# Altium schematic sheet 15_HEATER.SchDoc
size 420 x 297 mm; SheetNumber: 25; SheetTotal: 36
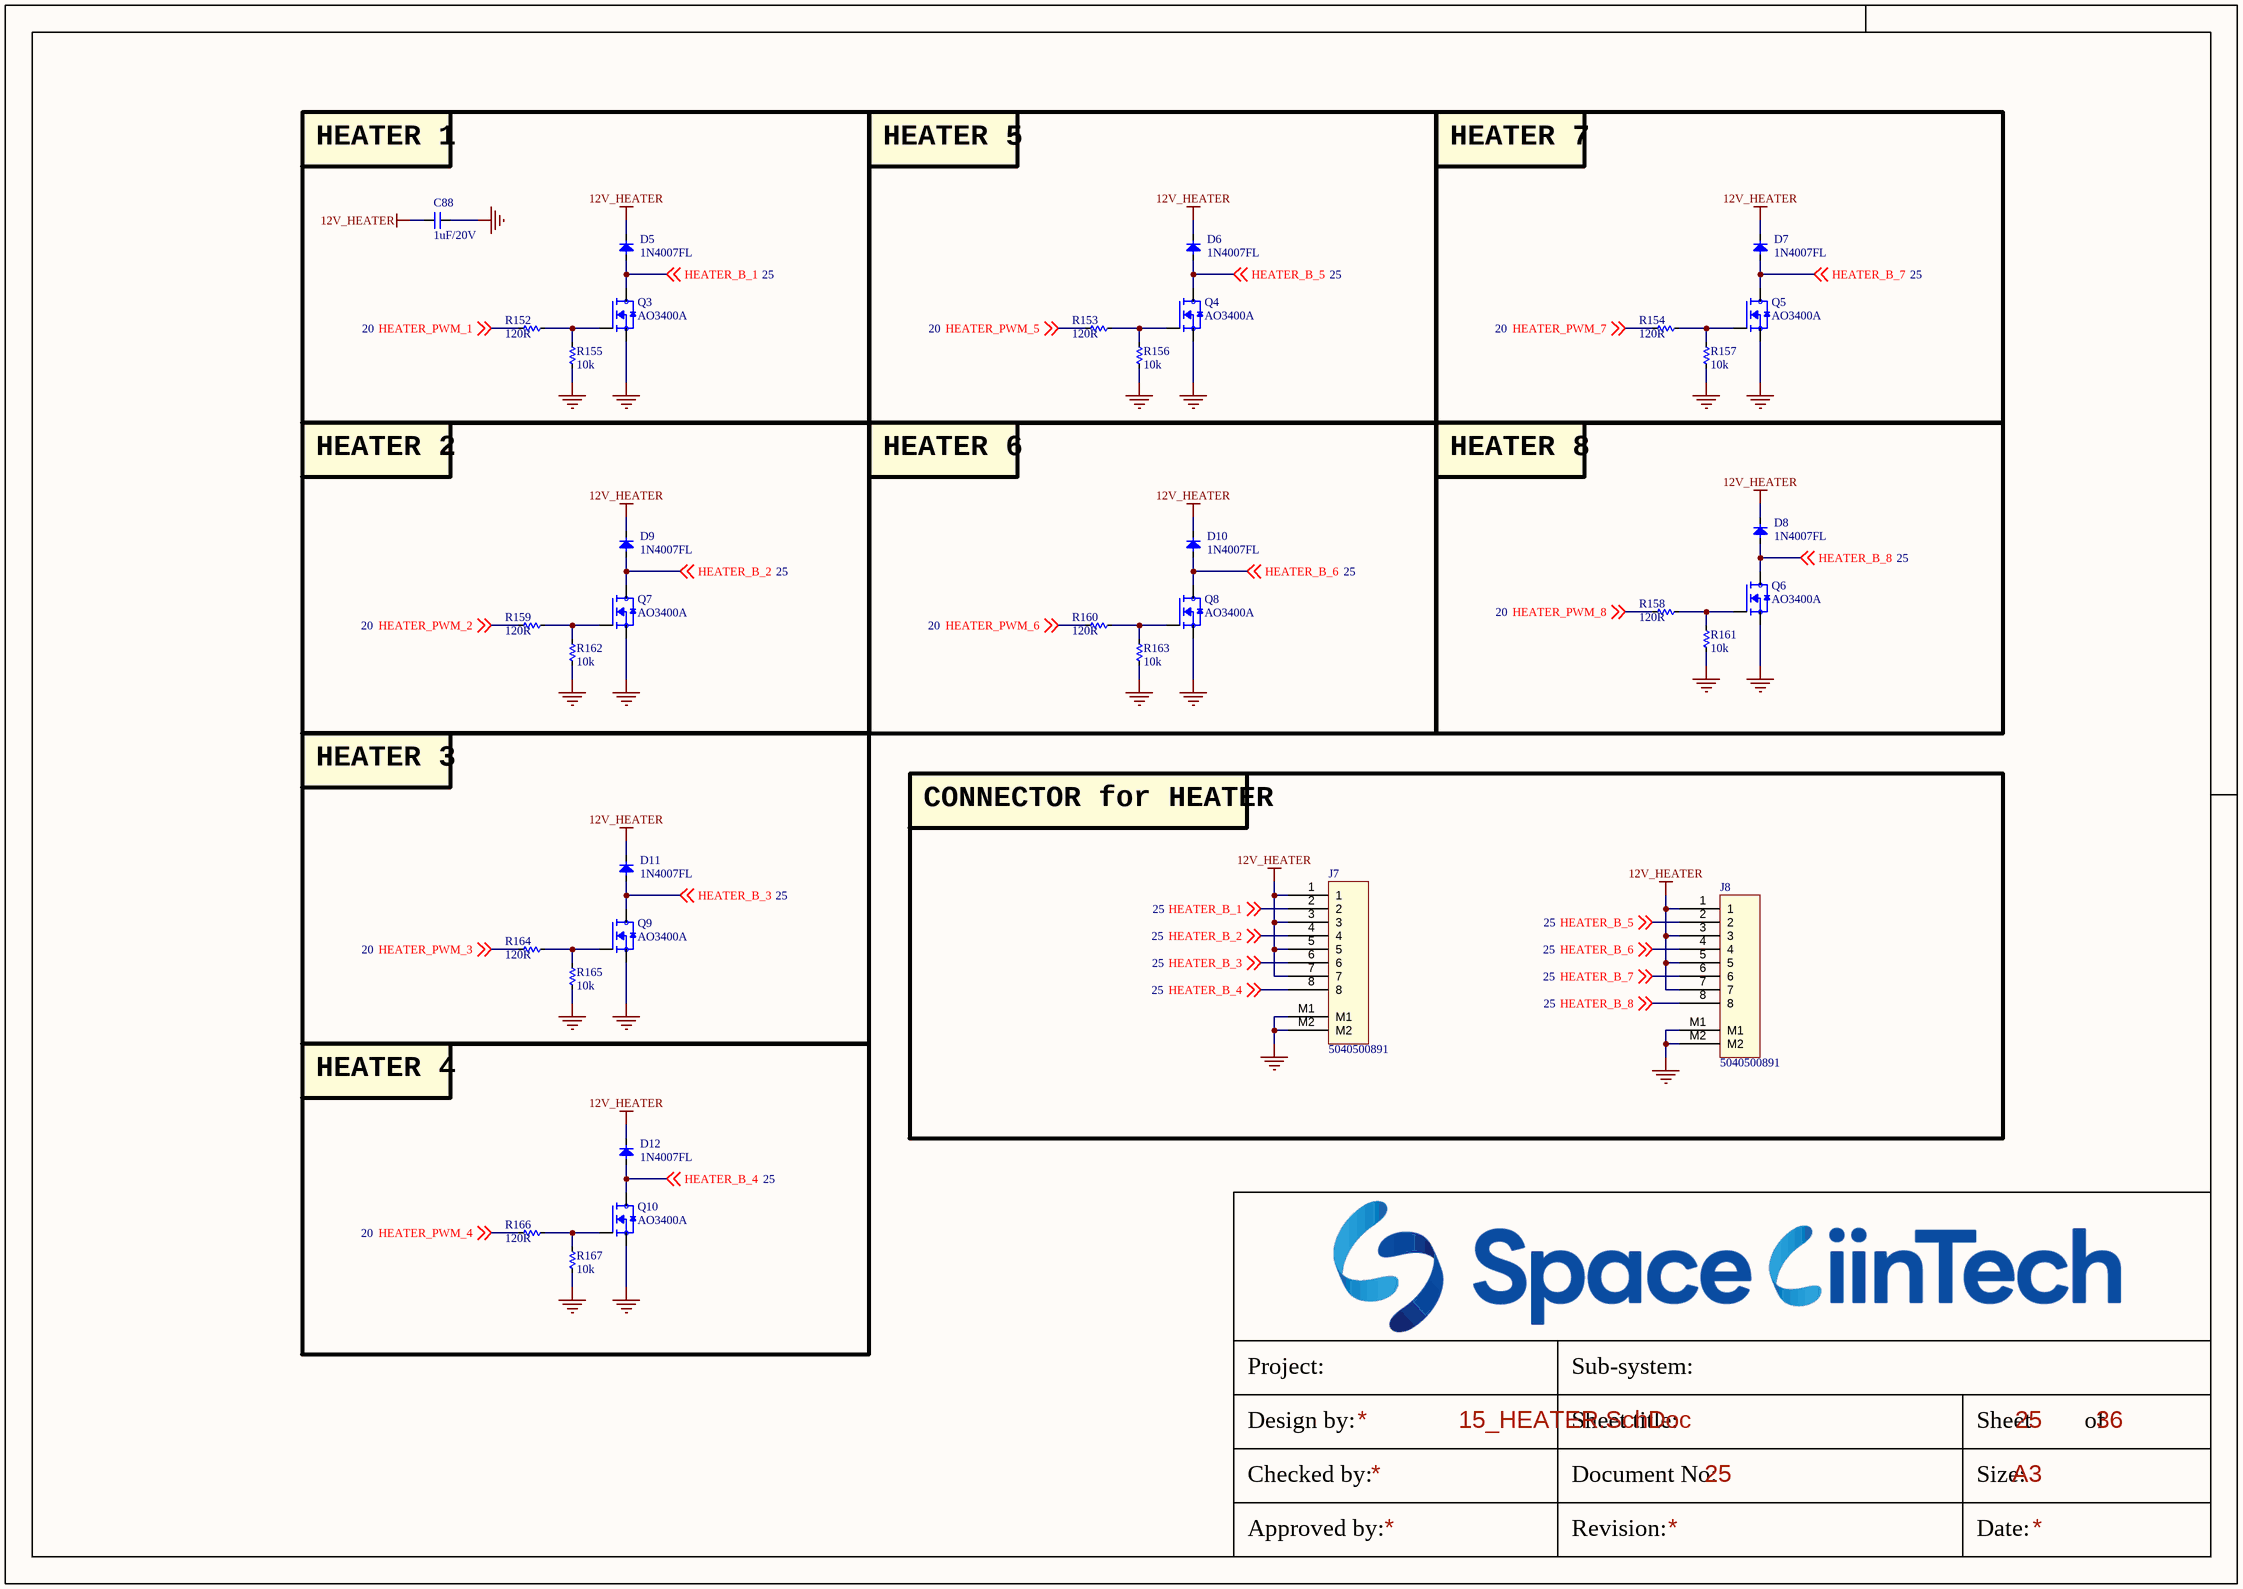
[diagram p0: 15_HEATER.SchDoc]

## Parts
C88  1uF/20V  [CAP_C_1005X60]
D5  1N4007FL  [SOD3717X145N]
D6  1N4007FL  [SOD3717X145N]
D7  1N4007FL  [SOD3717X145N]
D8  1N4007FL  [SOD3717X145N]
D9  1N4007FL  [SOD3717X145N]
D10  1N4007FL  [SOD3717X145N]
D11  1N4007FL  [SOD3717X145N]
D12  1N4007FL  [SOD3717X145N]
J7  5040500891  [MOLEX_5040500891]
J8  5040500891  [MOLEX_5040500891]
Q3  AO3400A  [SOT95P240X120-3N]
Q4  AO3400A  [SOT95P240X120-3N]
Q5  AO3400A  [SOT95P240X120-3N]
Q6  AO3400A  [SOT95P240X120-3N]
Q7  AO3400A  [SOT95P240X120-3N]
Q8  AO3400A  [SOT95P240X120-3N]
Q9  AO3400A  [SOT95P240X120-3N]
Q10  AO3400A  [SOT95P240X120-3N]
R152  120R  [RES_C_1005X40]
R153  120R  [RES_C_1005X40]
R154  120R  [RES_C_1005X40]
R155  10k  [RES_C_1005X40]
R156  10k  [RES_C_1005X40]
R157  10k  [RES_C_1005X40]
R158  120R  [RES_C_1005X40]
R159  120R  [RES_C_1005X40]
R160  120R  [RES_C_1005X40]
R161  10k  [RES_C_1005X40]
R162  10k  [RES_C_1005X40]
R163  10k  [RES_C_1005X40]
R164  120R  [RES_C_1005X40]
R165  10k  [RES_C_1005X40]
R166  120R  [RES_C_1005X40]
R167  10k  [RES_C_1005X40]

## Blocks framed on the sheet
HEATER 1: C88 D5 Q3 R152 R155
HEATER 5: D6 Q4 R153 R156
HEATER 7: D7 Q5 R154 R157
HEATER 2: D9 Q7 R159 R162
HEATER 6: D10 Q8 R160 R163
HEATER 8: D8 Q6 R158 R161
HEATER 3: D11 Q9 R164 R165
CONNECTOR for HEATER: J7 J8
HEATER 4: D12 Q10 R166 R167

## Nets
12V_HEATER: C88.2 D5.1(K) D6.1(K) D7.1(K) D8.1(K) D9.1(K) D10.1(K) D11.1(K) D12.1(K) J7.1 J7.3 J7.5 J7.7 J8.1 J8.3 J8.5 J8.7
GND: C88.1 J7.M1 J7.M2 J8.M1 J8.M2 Q3.2(S) Q4.2(S) Q5.2(S) Q6.2(S) Q7.2(S) Q8.2(S) Q9.2(S) Q10.2(S) R155.1 R156.1 R157.1 R161.1 R162.1 R163.1 R165.1 R167.1
HEATER_B_1: D5.2(A) J7.2 Q3.3(D) ; off-sheet HEATER_B_1
HEATER_B_2: D9.2(A) J7.4 Q7.3(D) ; off-sheet HEATER_B_2
HEATER_B_3: D11.2(A) J7.6 Q9.3(D) ; off-sheet HEATER_B_3
HEATER_B_4: D12.2(A) J7.8 Q10.3(D) ; off-sheet HEATER_B_4
HEATER_B_5: D6.2(A) J8.2 Q4.3(D) ; off-sheet HEATER_B_5
HEATER_B_6: D10.2(A) J8.4 Q8.3(D) ; off-sheet HEATER_B_6
HEATER_B_7: D7.2(A) J8.6 Q5.3(D) ; off-sheet HEATER_B_7
HEATER_B_8: D8.2(A) J8.8 Q6.3(D) ; off-sheet HEATER_B_8
HEATER_PWM_1: R152.1 ; off-sheet HEATER_PWM_1
HEATER_PWM_2: R159.1 ; off-sheet HEATER_PWM_2
HEATER_PWM_3: R164.1 ; off-sheet HEATER_PWM_3
HEATER_PWM_4: R166.1 ; off-sheet HEATER_PWM_4
HEATER_PWM_5: R153.1 ; off-sheet HEATER_PWM_5
HEATER_PWM_6: R160.1 ; off-sheet HEATER_PWM_6
HEATER_PWM_7: R154.1 ; off-sheet HEATER_PWM_7
HEATER_PWM_8: R158.1 ; off-sheet HEATER_PWM_8
NetQ3_1: Q3.1(G) R152.2 R155.2
NetQ4_1: Q4.1(G) R153.2 R156.2
NetQ5_1: Q5.1(G) R154.2 R157.2
NetQ6_1: Q6.1(G) R158.2 R161.2
NetQ7_1: Q7.1(G) R159.2 R162.2
NetQ8_1: Q8.1(G) R160.2 R163.2
NetQ9_1: Q9.1(G) R164.2 R165.2
NetQ10_1: Q10.1(G) R166.2 R167.2

## Notes on the sheet
- Project:
- Sub-system:
- Design by:
- Sheet title:
- Sheet
- of
- Checked by:
- Approved by:
- Revision:
- Document No:
- Size:
- Date:
- A3

## Library data of the parts
C88 = _CAP_C_2: CAP
D5-D12 = Diode SMD: Default Diode; Code - JEDEC: DO-214-AB; Value: 1N5007; Published: 8-Jun-2000; Revision: July-2002: Re-released for DXP Platform.; Publisher: Altium Limited
J7 J8 = Header 8x1_2M
Q3-Q10 = MOSFET_N: N-Channel 30 V 5.7A (Ta) 1.4W (Ta) Surface Mount SOT-23-3; MF: Alpha & Omega Semiconductor; SnapEDA_Link: https://www.snapeda.com/parts/AO3400A/Alpha/view-part/?ref=snap; Package: SOT-23 Alpha &amp; Omega Semiconductor Inc.; Value: *; MP: AO3400A; Check_prices: https://www.snapeda.com/parts/AO3400A/Alpha/view-part/?ref=eda
R152-R167 = _RES_B_2: RES